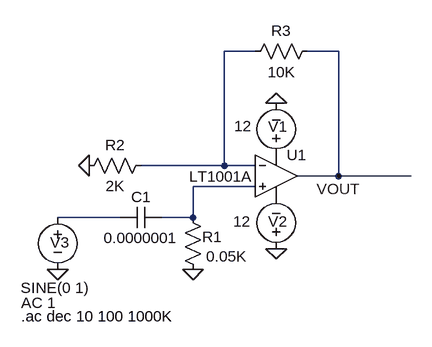
[diagram p0: schematic High-Pass Filter using Op Amp.asc]
High-Pass Filter using Op Amp.asc, the LTspice schematic file:
Version 4
SHEET 1 880 680
WIRE 256 -32 208 -32
WIRE 384 -32 336 -32
WIRE 208 144 208 -32
WIRE 208 144 80 144
WIRE 256 144 208 144
WIRE 384 160 384 -32
WIRE 384 160 320 160
WIRE 496 160 384 160
WIRE 256 176 160 176
WIRE 48 224 -48 224
WIRE 160 224 160 176
WIRE 160 224 112 224
FLAG 288 48 0
FLAG 288 272 0
FLAG 160 304 0
FLAG 0 144 0
FLAG -48 304 0
FLAG 384 160 VOUT
SYMBOL voltage 288 144 R180
WINDOW 0 -17 60 Left 2
WINDOW 3 38 61 Left 2
SYMATTR InstName V1
SYMATTR Value 12
SYMBOL voltage 288 288 R180
WINDOW 0 -17 58 Left 2
WINDOW 3 39 58 Left 2
WINDOW 123 0 0 Left 0
WINDOW 39 0 0 Left 0
SYMATTR InstName V2
SYMATTR Value 12
SYMBOL voltage -48 208 R0
WINDOW 0 -12 54 Left 2
WINDOW 3 -57 124 Left 2
WINDOW 123 -56 147 Left 2
WINDOW 39 0 0 Left 0
SYMATTR InstName V3
SYMATTR Value SINE(0 1)
SYMATTR Value2 AC 1
SYMBOL OpAmps\\LT1001A 288 96 R0
WINDOW 3 -134 65 Left 2
SYMATTR InstName U1
SYMBOL res 144 208 R0
WINDOW 0 30 46 Left 2
SYMATTR InstName R1
SYMATTR Value 0.05K
SYMBOL res 96 128 R90
WINDOW 0 0 56 VBottom 2
WINDOW 3 32 56 VTop 2
SYMATTR InstName R2
SYMATTR Value 2K
SYMBOL res 352 -48 R90
WINDOW 0 0 56 VBottom 2
WINDOW 3 32 56 VTop 2
SYMATTR InstName R3
SYMATTR Value 10K
SYMBOL cap 112 208 R90
WINDOW 0 0 32 VBottom 2
WINDOW 3 32 32 VTop 2
SYMATTR InstName C1
SYMATTR Value 0.0000001
TEXT -104 376 Left 2 !.ac dec 10 100 1000K

The netlist it stands for:
* High-Pass Filter using Op Amp.asc
V1 P001 0 12
V2 0 P002 12
V3 N003 0 SINE(0 1) AC 1
XU1 N002 N001 P001 P002 VOUT LT1001  ; LT1001A, pins In+ In- V+ V- OUT
R1 N002 0 0.05K
R2 N001 0 2K
R3 VOUT N001 10K
C1 N002 N003 0.0000001
.ac dec 10 100 1000K
.lib LTC.lib
.backanno
.end